# EAGLE schematic stereo_mix (EAGLE 9.4.2)

## Sheet 1 of 2: Channels
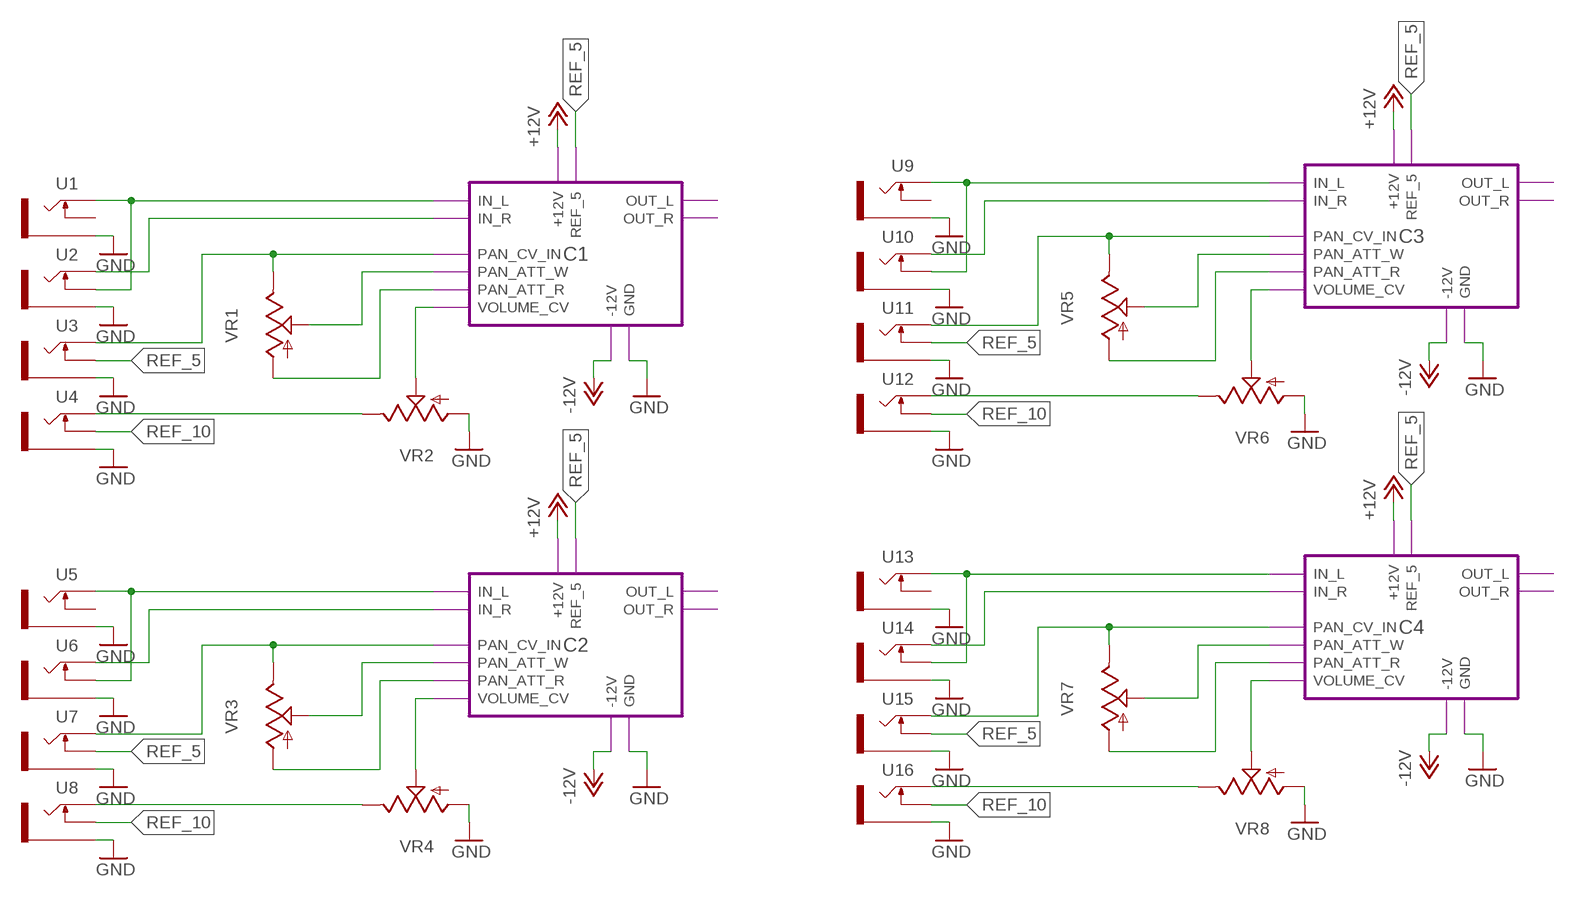
[diagram p0: schematic, sheet 1]

### Parts
U1  THONKICONNNEW  [WQP-PJ301M-12_JACK]
U2  THONKICONNNEW  [WQP-PJ301M-12_JACK]
U3  THONKICONNNEW  [WQP-PJ301M-12_JACK]
U4  THONKICONNNEW  [WQP-PJ301M-12_JACK]
U5  THONKICONNNEW  [WQP-PJ301M-12_JACK]
U6  THONKICONNNEW  [WQP-PJ301M-12_JACK]
U7  THONKICONNNEW  [WQP-PJ301M-12_JACK]
U8  THONKICONNNEW  [WQP-PJ301M-12_JACK]
U9  THONKICONNNEW  [WQP-PJ301M-12_JACK]
U10  THONKICONNNEW  [WQP-PJ301M-12_JACK]
U11  THONKICONNNEW  [WQP-PJ301M-12_JACK]
U12  THONKICONNNEW  [WQP-PJ301M-12_JACK]
U13  THONKICONNNEW  [WQP-PJ301M-12_JACK]
U14  THONKICONNNEW  [WQP-PJ301M-12_JACK]
U15  THONKICONNNEW  [WQP-PJ301M-12_JACK]
U16  THONKICONNNEW  [WQP-PJ301M-12_JACK]
VR1  9MM_SNAP-IN_POT_  [9MM_SNAP-IN_POT]
VR2  9MM_SNAP-IN_POT_  [9MM_SNAP-IN_POT]
VR3  9MM_SNAP-IN_POT_  [9MM_SNAP-IN_POT]
VR4  9MM_SNAP-IN_POT_  [9MM_SNAP-IN_POT]
VR5  9MM_SNAP-IN_POT_  [9MM_SNAP-IN_POT]
VR6  9MM_SNAP-IN_POT_  [9MM_SNAP-IN_POT]
VR7  9MM_SNAP-IN_POT_  [9MM_SNAP-IN_POT]
VR8  9MM_SNAP-IN_POT_  [9MM_SNAP-IN_POT]

### Module instances
C2 = CHANNEL
C3 = CHANNEL
C4 = CHANNEL
C1 = CHANNEL

### Nets
+12V: port C2.+12V C3.+12V C4.+12V C1.+12V
-12V: port C2.-12V C3.-12V C4.-12V C1.-12V
GND: U1.P$3_SLEEVE(SLEEVE) U2.P$3_SLEEVE(SLEEVE) U3.P$3_SLEEVE(SLEEVE) U4.P$3_SLEEVE(SLEEVE) U5.P$3_SLEEVE(SLEEVE) U6.P$3_SLEEVE(SLEEVE) U7.P$3_SLEEVE(SLEEVE) U8.P$3_SLEEVE(SLEEVE) U9.P$3_SLEEVE(SLEEVE) U10.P$3_SLEEVE(SLEEVE) U11.P$3_SLEEVE(SLEEVE) U12.P$3_SLEEVE(SLEEVE) U13.P$3_SLEEVE(SLEEVE) U14.P$3_SLEEVE(SLEEVE) U15.P$3_SLEEVE(SLEEVE) U16.P$3_SLEEVE(SLEEVE) VR2.1(A) VR4.1(A) VR6.1(A) VR8.1(A) ; port C2.GND C3.GND C4.GND C1.GND ; also sheet 2
N$1: U1.P$1_TIP(TIP) U2.P$2_SWITCH(SWITCH) ; port C1.IN_L
N$2: U2.P$1_TIP(TIP) ; port C1.IN_R
N$3: VR1.2(S) ; port C1.PAN_ATT_W
N$4: U5.P$1_TIP(TIP) U6.P$2_SWITCH(SWITCH) ; port C2.IN_L
N$5: U3.P$1_TIP(TIP) VR1.3(E) ; port C1.PAN_CV_IN
N$6: VR1.1(A) ; port C1.PAN_ATT_R
N$7: VR2.2(S) ; port C1.VOLUME_CV
N$8: U6.P$1_TIP(TIP) ; port C2.IN_R
N$9: VR3.2(S) ; port C2.PAN_ATT_W
N$10: U7.P$1_TIP(TIP) VR3.3(E) ; port C2.PAN_CV_IN
N$11: VR3.1(A) ; port C2.PAN_ATT_R
N$12: VR4.2(S) ; port C2.VOLUME_CV
N$13: U8.P$1_TIP(TIP) VR4.3(E)
N$14: U9.P$1_TIP(TIP) U10.P$2_SWITCH(SWITCH) ; port C3.IN_L
N$15: U10.P$1_TIP(TIP) ; port C3.IN_R
N$16: VR5.2(S) ; port C3.PAN_ATT_W
N$17: U4.P$1_TIP(TIP) VR2.3(E)
N$18: U11.P$1_TIP(TIP) VR5.3(E) ; port C3.PAN_CV_IN
N$19: VR5.1(A) ; port C3.PAN_ATT_R
N$20: VR6.2(S) ; port C3.VOLUME_CV
N$21: U12.P$1_TIP(TIP) VR6.3(E)
N$22: U13.P$1_TIP(TIP) U14.P$2_SWITCH(SWITCH) ; port C4.IN_L
N$23: U14.P$1_TIP(TIP) ; port C4.IN_R
N$24: VR7.2(S) ; port C4.PAN_ATT_W
N$25: U15.P$1_TIP(TIP) VR7.3(E) ; port C4.PAN_CV_IN
N$26: VR7.1(A) ; port C4.PAN_ATT_R
N$27: VR8.2(S) ; port C4.VOLUME_CV
N$28: U16.P$1_TIP(TIP) VR8.3(E)
REF_5: U3.P$2_SWITCH(SWITCH) U7.P$2_SWITCH(SWITCH) U11.P$2_SWITCH(SWITCH) U15.P$2_SWITCH(SWITCH)
REF_10: U4.P$2_SWITCH(SWITCH) U8.P$2_SWITCH(SWITCH) U12.P$2_SWITCH(SWITCH) U16.P$2_SWITCH(SWITCH)
Unconnected: U1.P$2_SWITCH(SWITCH) U5.P$2_SWITCH(SWITCH) U9.P$2_SWITCH(SWITCH) U13.P$2_SWITCH(SWITCH)

## Sheet 2 of 2: Output
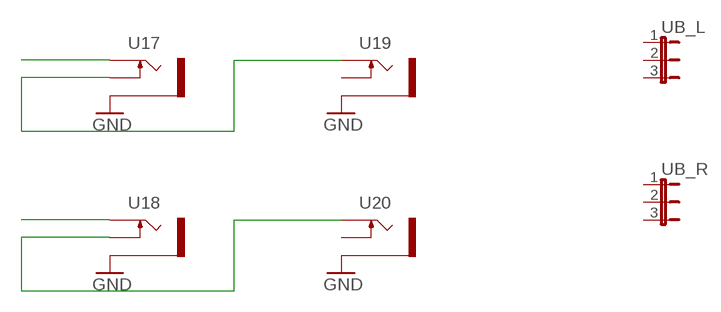
[diagram p1: schematic, sheet 2]

### Parts
U17  THONKICONNNEW  [WQP-PJ301M-12_JACK]
U18  THONKICONNNEW  [WQP-PJ301M-12_JACK]
U19  THONKICONNNEW  [WQP-PJ301M-12_JACK]
U20  THONKICONNNEW  [WQP-PJ301M-12_JACK]
UB_L  JP2E  [JP2]
UB_R  JP2E  [JP2]

### Nets
GND: U17.P$3_SLEEVE(SLEEVE) U18.P$3_SLEEVE(SLEEVE) U19.P$3_SLEEVE(SLEEVE) U20.P$3_SLEEVE(SLEEVE) ; also sheet 1
N$29: U17.P$1_TIP(TIP)
N$30: U18.P$1_TIP(TIP)
N$31: U18.P$2_SWITCH(SWITCH) U20.P$1_TIP(TIP)
N$32: U17.P$2_SWITCH(SWITCH) U19.P$1_TIP(TIP)
Unconnected: U19.P$2_SWITCH(SWITCH) U20.P$2_SWITCH(SWITCH) UB_L.1 UB_L.2 UB_L.3 UB_R.1 UB_R.2 UB_R.3

## Library data of the parts
U1-U20 = MusicThingModular:THONKICONN: 3.5mm socket for Eurorack modular synths
UB_L UB_R = jumper:JP2E: JUMPER
VR1-VR8 = MusicThingModular:9MM_SNAP-IN_POT: 9mm vertical snap-in pot, Alpha / Panasonic style; SPICEPREFIX: J

## Module CHANNEL
Ports: IN_L(in) IN_R(in) PAN_CV_IN(in) PAN_ATT_W(in) PAN_ATT_R(in) VOLUME_CV(in) -12V(pwr) GND(pwr) +12V(pwr) REF_5(pwr) OUT_L(out) OUT_R(out)
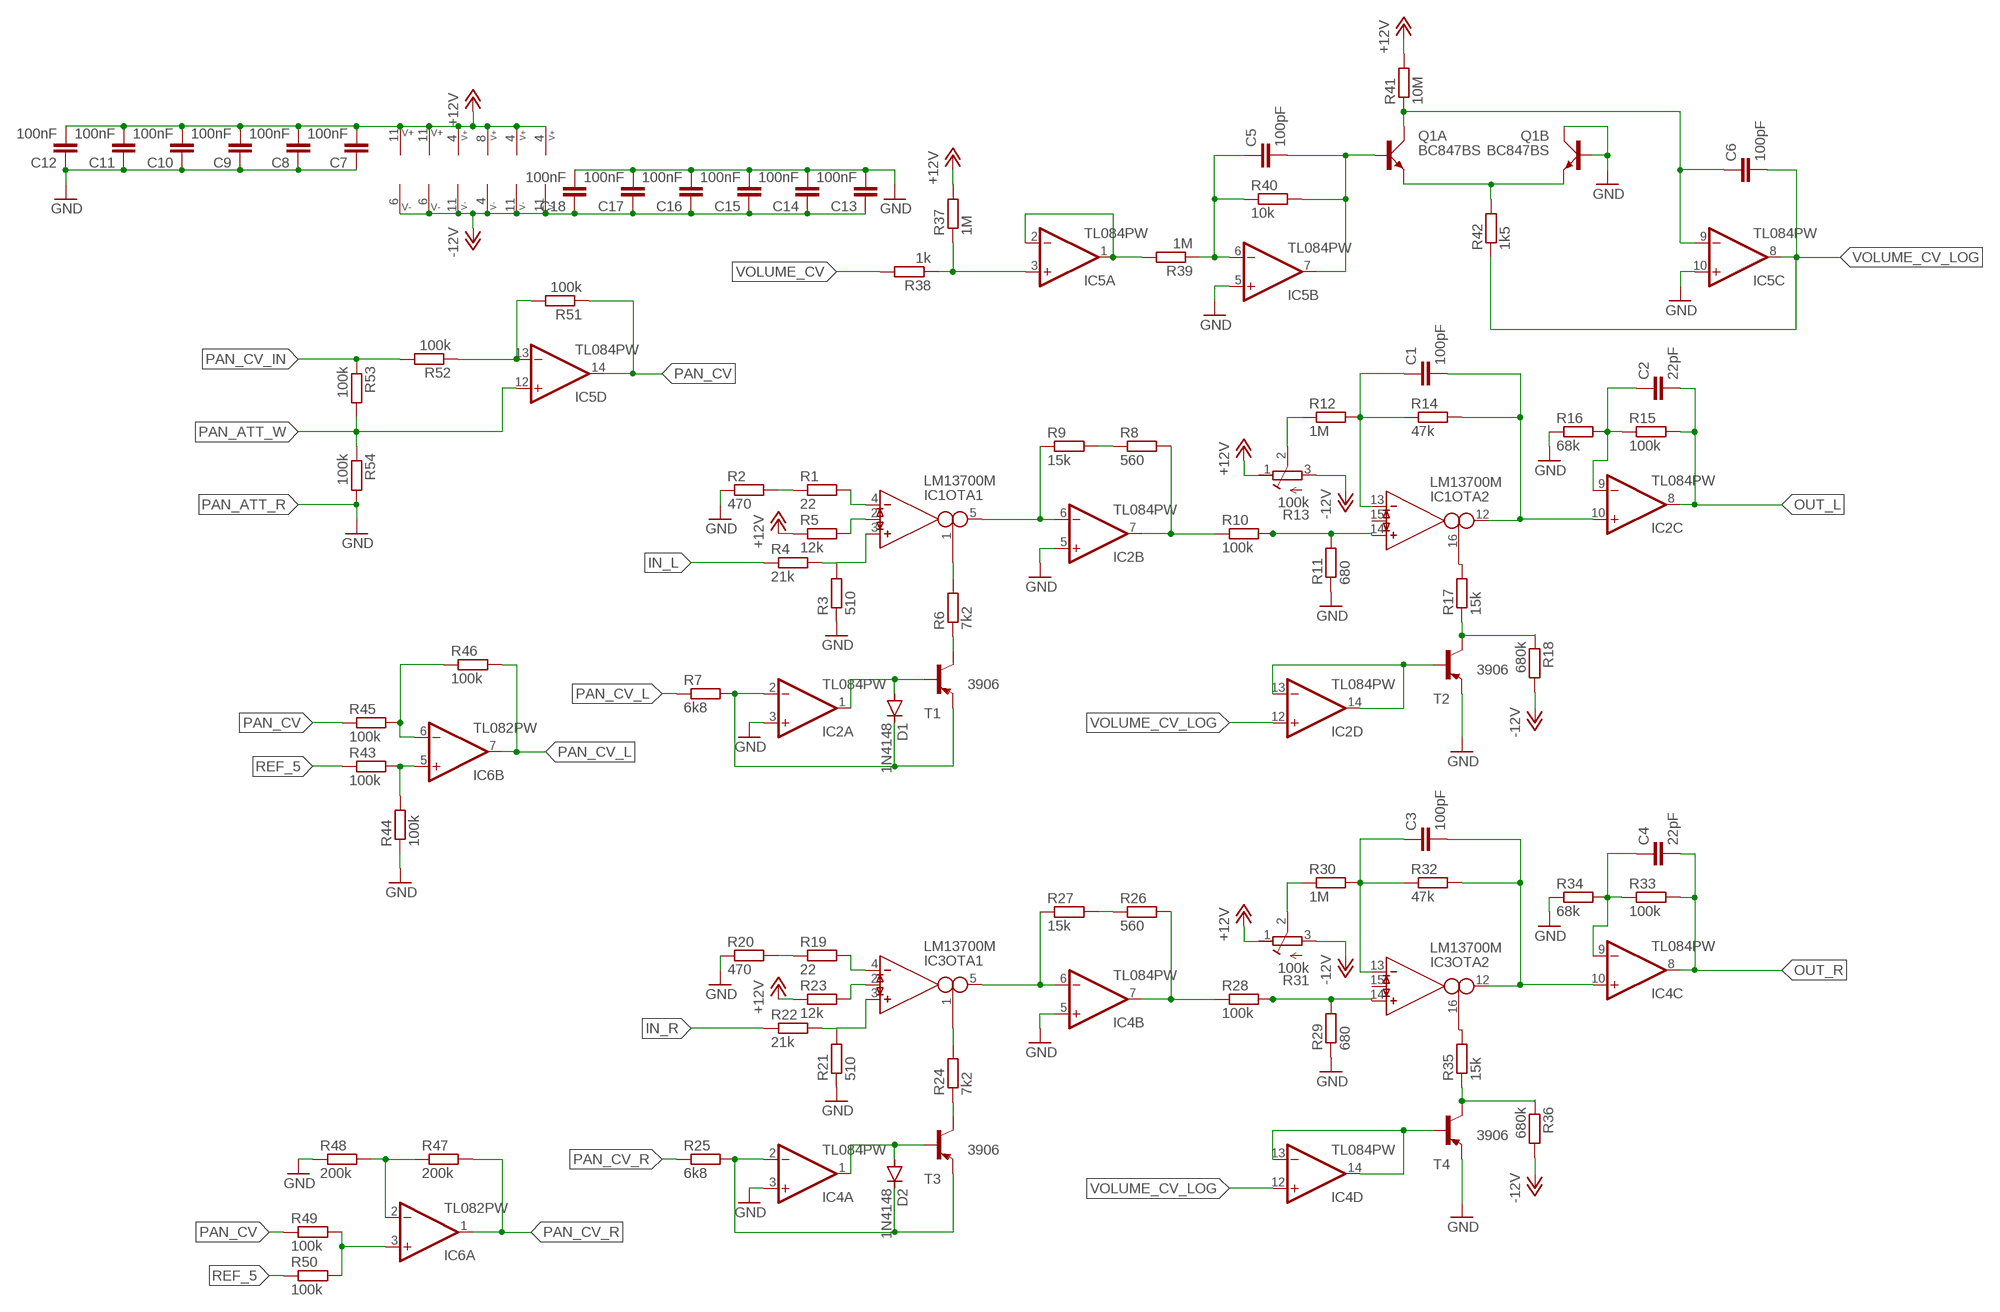
[diagram p2: schematic, module CHANNEL, sheet 1]

### Parts
C1  100pF  C-EUC0603  [C0603]
C2  22pF  C-EUC0603  [C0603]
C3  100pF  C-EUC0603  [C0603]
C4  22pF  C-EUC0603  [C0603]
C5  100pF  C-EUC0603  [C0603]
C6  100pF  C-EUC0603  [C0603]
C7  100nF  C-EUC0603  [C0603]
C8  100nF  C-EUC0603  [C0603]
C9  100nF  C-EUC0603  [C0603]
C10  100nF  C-EUC0603  [C0603]
C11  100nF  C-EUC0603  [C0603]
C12  100nF  C-EUC0603  [C0603]
C13  100nF  C-EUC0603  [C0603]
C14  100nF  C-EUC0603  [C0603]
C15  100nF  C-EUC0603  [C0603]
C16  100nF  C-EUC0603  [C0603]
C17  100nF  C-EUC0603  [C0603]
C18  100nF  C-EUC0603  [C0603]
D1  1N4148  DIODE-SOD323-W  [SOD323-W]
D2  1N4148  DIODE-SOD323-W  [SOD323-W]
IC1  LM13700M  [SO16]
IC2  TL084PW  [TSSOP14]
IC3  LM13700M  [SO16]
IC4  TL084PW  [TSSOP14]
IC5  TL084PW  [TSSOP14]
IC6  TL082PW  [TSSOP8]
Q1  BC847BS  [SOT363_PHILIPS]
R1  22  R-EU_R0603  [R0603]
R2  470  R-EU_R0603  [R0603]
R3  510  R-EU_R0603  [R0603]
R4  21k  R-EU_R0603  [R0603]
R5  12k  R-EU_R0603  [R0603]
R6  7k2  R-EU_R0603  [R0603]
R7  6k8  R-EU_R0603  [R0603]
R8  560  R-EU_R0603  [R0603]
R9  15k  R-EU_R0603  [R0603]
R10  100k  R-EU_R0603  [R0603]
R11  680  R-EU_R0603  [R0603]
R12  1M  R-EU_R0603  [R0603]
R13  100k  R-TRIMMT93YA  [RTRIMT93YA]
R14  47k  R-EU_R0603  [R0603]
R15  100k  R-EU_R0603  [R0603]
R16  68k  R-EU_R0603  [R0603]
R17  15k  R-EU_R0603  [R0603]
R18  680k  R-EU_R0603  [R0603]
R19  22  R-EU_R0603  [R0603]
R20  470  R-EU_R0603  [R0603]
R21  510  R-EU_R0603  [R0603]
R22  21k  R-EU_R0603  [R0603]
R23  12k  R-EU_R0603  [R0603]
R24  7k2  R-EU_R0603  [R0603]
R25  6k8  R-EU_R0603  [R0603]
R26  560  R-EU_R0603  [R0603]
R27  15k  R-EU_R0603  [R0603]
R28  100k  R-EU_R0603  [R0603]
R29  680  R-EU_R0603  [R0603]
R30  1M  R-EU_R0603  [R0603]
R31  100k  R-TRIMMT93YA  [RTRIMT93YA]
R32  47k  R-EU_R0603  [R0603]
R33  100k  R-EU_R0603  [R0603]
R34  68k  R-EU_R0603  [R0603]
R35  15k  R-EU_R0603  [R0603]
R36  680k  R-EU_R0603  [R0603]
R37  1M  R-EU_R0603  [R0603]
R38  1k  R-EU_R0603  [R0603]
R39  1M  R-EU_R0603  [R0603]
R40  10k  R-EU_R0603  [R0603]
R41  10M  R-EU_R0603  [R0603]
R42  1k5  R-EU_R0603  [R0603]
R43  100k  R-EU_R0603  [R0603]
R44  100k  R-EU_R0603  [R0603]
R45  100k  R-EU_R0603  [R0603]
R46  100k  R-EU_R0603  [R0603]
R47  200k  R-EU_R0603  [R0603]
R48  200k  R-EU_R0603  [R0603]
R49  100k  R-EU_R0603  [R0603]
R50  100k  R-EU_R0603  [R0603]
R51  100k  R-EU_R0603  [R0603]
R52  100k  R-EU_R0603  [R0603]
R53  100k  R-EU_R0603  [R0603]
R54  100k  R-EU_R0603  [R0603]
T1  3906  MMBT3906LT1-PNP-SOT23-BEC  [SOT23-BEC]
T2  3906  MMBT3906LT1-PNP-SOT23-BEC  [SOT23-BEC]
T3  3906  MMBT3906LT1-PNP-SOT23-BEC  [SOT23-BEC]
T4  3906  MMBT3906LT1-PNP-SOT23-BEC  [SOT23-BEC]

### Nets
+12V: C7.2 C8.2 C9.2 C10.2 C11.2 C12.2 IC1.11(SUPPLY:V+) IC2.4(P:V+) IC3.11(SUPPLY:V+) IC4.4(P:V+) IC5.4(P:V+) IC6.8(P:V+) R5.1 R13.1(E) R23.1 R31.1(E) R37.2 R41.2
-12V: C13.1 C14.1 C15.1 C16.1 C17.1 C18.1 IC1.6(SUPPLY:V-) IC2.11(P:V-) IC3.6(SUPPLY:V-) IC4.11(P:V-) IC5.11(P:V-) IC6.4(P:V-) R13.3(A) R18.2 R31.3(A) R36.2
GND: C7.1 C8.1 C9.1 C10.1 C11.1 C12.1 C13.2 C14.2 C15.2 C16.2 C17.2 C18.2 IC2.3(A:+IN) IC2.5(B:+IN) IC4.3(A:+IN) IC4.5(B:+IN) IC5.5(B:+IN) IC5.10(C:+IN) Q1.3(B:C) Q1.5(B:B) R2.1 R3.1 R11.1 R16.1 R20.1 R21.1 R29.1 R34.1 R44.1 R48.1 T2.E T4.E
IN_L: R4.1
IN_R: R22.1
N$1: IC1.4(OTA1:IN_N) R1.2
N$2: R1.1 R2.2
N$3: IC1.3(OTA1:IN_P) R3.2 R4.2
N$4: IC1.1(OTA1:I_BIAS) R6.2
N$5: IC1.2(OTA1:I_DIODE) R5.2
N$6: R6.1 T1.C
N$7: D1.A IC2.1(A:OUT) T1.B
N$8: D1.C IC2.2(A:-IN) R7.2 T1.E
N$9: IC1.5(OTA1:OUT) IC2.6(B:-IN) R9.1
N$10: R8.1 R9.2
N$11: IC2.7(B:OUT) R8.2 R10.1
N$12: C1.1 IC1.13(OTA2:IN_N) R12.2 R14.1
N$13: IC1.14(OTA2:IN_P) R10.2 R11.2
N$14: R12.1 R13.2(S)
N$15: C2.1 IC2.9(C:-IN) R15.1 R16.2
N$16: C1.2 IC1.12(OTA2:OUT) IC2.10(C:+IN) R14.2
N$17: IC1.16(OTA2:I_BIAS) R17.2
N$18: R17.1 R18.1 T2.C
N$19: IC2.13(D:-IN) IC2.14(D:OUT) T2.B
N$20: IC3.4(OTA1:IN_N) R19.2
N$21: R19.1 R20.2
N$22: IC3.3(OTA1:IN_P) R21.2 R22.2
N$23: IC3.2(OTA1:I_DIODE) R23.2
N$24: IC3.1(OTA1:I_BIAS) R24.2
N$25: R24.1 T3.C
N$26: D2.A IC4.1(A:OUT) T3.B
N$27: D2.C IC4.2(A:-IN) R25.2 T3.E
N$28: IC3.5(OTA1:OUT) IC4.6(B:-IN) R27.1
N$29: R26.1 R27.2
N$30: IC4.7(B:OUT) R26.2 R28.1
N$31: IC3.14(OTA2:IN_P) R28.2 R29.2
N$32: C3.1 IC3.13(OTA2:IN_N) R30.2 R32.1
N$33: R30.1 R31.2(S)
N$34: C3.2 IC3.12(OTA2:OUT) IC4.10(C:+IN) R32.2
N$35: C4.1 IC4.9(C:-IN) R33.1 R34.2
N$36: IC3.16(OTA2:I_BIAS) R35.2
N$37: R35.1 R36.1 T4.C
N$38: IC4.13(D:-IN) IC4.14(D:OUT) T4.B
N$39: IC5.1(A:OUT) IC5.2(A:-IN) R39.2
N$40: IC5.3(A:+IN) R37.1 R38.1
N$41: C5.1 IC5.6(B:-IN) R39.1 R40.1
N$42: C5.2 IC5.7(B:OUT) Q1.2(A:B) R40.2
N$43: IC6.5(B:+IN) R43.2 R44.2
N$44: C6.1 IC5.9(C:-IN) Q1.6(A:C) R41.1
N$45: IC6.6(B:-IN) R45.2 R46.1
N$46: Q1.1(A:E) Q1.4(B:E) R42.2
N$47: IC6.2(A:-IN) R47.1 R48.2
N$48: IC5.13(D:-IN) R51.2 R52.1
N$50: IC6.3(A:+IN) R49.2 R50.2
OUT_L: C2.2 IC2.8(C:OUT) R15.2
OUT_R: C4.2 IC4.8(C:OUT) R33.2
PAN_ATT_R: R54.2 ; supply symbol labelled GND
PAN_ATT_W: IC5.12(D:+IN) R53.2 R54.1
PAN_CV: IC5.14(D:OUT) R45.1 R49.1 R51.1
PAN_CV_IN: R52.2 R53.1
PAN_CV_L: IC6.7(B:OUT) R7.1 R46.2
PAN_CV_R: IC6.1(A:OUT) R25.1 R47.2
REF_5: R43.1 R50.1
VOLUME_CV: R38.2
VOLUME_CV_LOG: C6.2 IC2.12(D:+IN) IC4.12(D:+IN) IC5.8(C:OUT) R42.1
Unconnected: IC1.7(BUF1:B) IC1.8(BUF1:E) IC1.9(BUF2:E) IC1.10(BUF2:B) IC1.15(OTA2:I_DIODE) IC3.7(BUF1:B) IC3.8(BUF1:E) IC3.9(BUF2:E) IC3.10(BUF2:B) IC3.15(OTA2:I_DIODE)

### Library data of the parts
C1-C18 = rcl:C-EU: CAPACITOR, European symbol; SPICEPREFIX: C
D1 D2 = diode:DIODE-: DIODE
IC1 IC3 = ota:LM13700: Dual OTA with buffers
IC2 IC4 IC5 = op-amp:TL084: JFET OP-AMP - Quad
IC6 = op-amp:TL082: JFET OP-AMP - Dual
Q1 = transistor-small-signal:BC847BS: NPN general purpose double transistor Source: http://www.farnell.com/datasheets/2466.pdf
R1-R12 R14-R30 R32-R54 = rcl:R-EU_: RESISTOR, European symbol; SPICEPREFIX: R
R13 R31 = rcl:R-TRIMM: Trimm resistor; SPICEMODEL: X; SPICEPREFIXL: POT
T1-T4 = transistor-neu-to92:*-PNP-: PNP Transistror